# EAGLE schematic ohms-law (EAGLE 7.7.0)
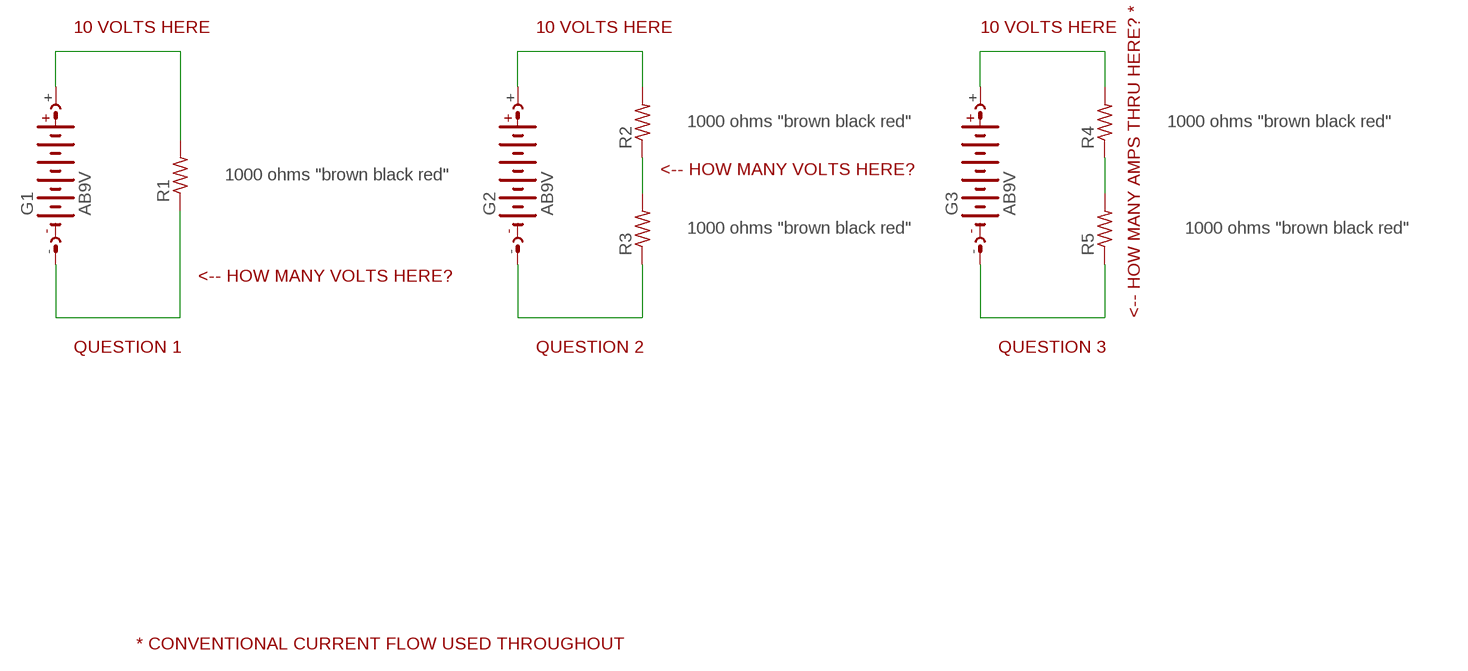
[diagram p0: schematic, sheet 1]

## Parts
G1  AB9V  [AB9V]
G2  AB9V  [AB9V]
G3  AB9V  [AB9V]
R1  1000 ohms "brown black red"  R-US_M0805  [M0805]
R2  1000 ohms "brown black red"  R-US_M0805  [M0805]
R3  1000 ohms "brown black red"  R-US_M0805  [M0805]
R4  1000 ohms "brown black red"  R-US_M0805  [M0805]
R5  1000 ohms "brown black red"  R-US_M0805  [M0805]

## Nets
N$1: G1.- R1.1
N$2: G1.+ R1.2
N$3: G2.- R3.1
N$4: G2.+ R2.2
N$5: R2.1 R3.2
N$6: G3.- R5.1
N$7: G3.+ R4.2
N$8: R4.1 R5.2

## Notes on the sheet
- 10 VOLTS HERE | 10 VOLTS HERE | 10 VOLTS HERE
- <-- HOW MANY VOLTS HERE?
- <-- HOW MANY VOLTS HERE?
- <-- HOW MANY AMPS THRU HERE? *
- QUESTION 1 | QUESTION 2 | QUESTION 3
- * CONVENTIONAL CURRENT FLOW USED THROUGHOUT

## Library data of the parts
G1-G3 = battery:AB9V: 9-V BATTERY CLIP
R1-R5 = resistor:R-US_: RESISTOR, American symbol